# Altium project LEDS RGB.PrjPcb
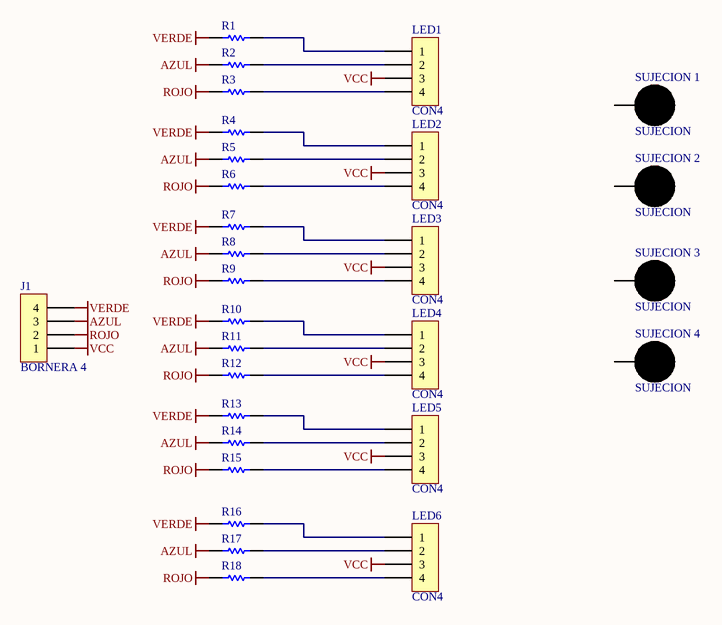
[diagram p0: LEDS RGB.SchDoc]
1 sheet, 29 parts. Net scope: global (net labels, ports and power ports of the same name join across sheets).
Board file: LEDS RGB.PcbDoc

## Sheet LEDS RGB.SchDoc
size A4

### Parts
J1  BORNERA 4  [BORNERA4]
LED1  CON4  [SIP4]
LED2  CON4  [SIP4]
LED3  CON4  [SIP4]
LED4  CON4  [SIP4]
LED5  CON4  [SIP4]
LED6  CON4  [SIP4]
R1  RES  [RES400]  (value not drawn)
R2  RES  [RES400]  (value not drawn)
R3  RES  [RES400]  (value not drawn)
R4  RES  [RES400]  (value not drawn)
R5  RES  [RES400]  (value not drawn)
R6  RES  [RES400]  (value not drawn)
R7  RES  [RES400]  (value not drawn)
R8  RES  [RES400]  (value not drawn)
R9  RES  [RES400]  (value not drawn)
R10  RES  [RES400]  (value not drawn)
R11  R12  [RES400]  (value not drawn)
R12  RES  [RES400]  (value not drawn)
R13  RES  [RES400]  (value not drawn)
R14  RES  [RES400]  (value not drawn)
R15  RES  [RES400]  (value not drawn)
R16  RES  [RES400]  (value not drawn)
R17  RES  [RES400]  (value not drawn)
R18  RES  [RES400]  (value not drawn)
SUJECION_1  SUJECION  [SUJECION (5.00MM - 3.50MM)]
SUJECION_2  SUJECION  [SUJECION (5.00MM - 3.50MM)]
SUJECION_3  SUJECION  [SUJECION (5.00MM - 3.50MM)]
SUJECION_4  SUJECION  [SUJECION (5.00MM - 3.50MM)]

### Nets
AZUL: J1.3 R2.1 R5.1 R8.1 R11.1 R14.1 R17.1
ROJO: J1.2 R3.1 R6.1 R9.1 R12.1 R15.1 R18.1
VCC: J1.1 LED1.3 LED2.3 LED3.3 LED4.3 LED5.3 LED6.3
VERDE: J1.4 R1.1 R4.1 R7.1 R10.1 R13.1 R16.1
NetLED1_1: LED1.1 R1.2
NetLED1_2: LED1.2 R2.2
NetLED1_4: LED1.4 R3.2
NetLED2_1: LED2.1 R4.2
NetLED2_2: LED2.2 R5.2
NetLED2_4: LED2.4 R6.2
NetLED3_1: LED3.1 R7.2
NetLED3_2: LED3.2 R8.2
NetLED3_4: LED3.4 R9.2
NetLED4_1: LED4.1 R10.2
NetLED4_2: LED4.2 R11.2
NetLED4_4: LED4.4 R12.2
NetLED5_1: LED5.1 R13.2
NetLED5_2: LED5.2 R14.2
NetLED5_4: LED5.4 R15.2
NetLED6_1: LED6.1 R16.2
NetLED6_2: LED6.2 R17.2
NetLED6_4: LED6.4 R18.2

Not connected (* = marked no-connect by the designer): SUJECION_1 1; SUJECION_2 1; SUJECION_3 1; SUJECION_4 1

### Library data of the parts
R11 = RES